# EAGLE design USB_Type_A_Female_Breakout (EAGLE 6.5.0)
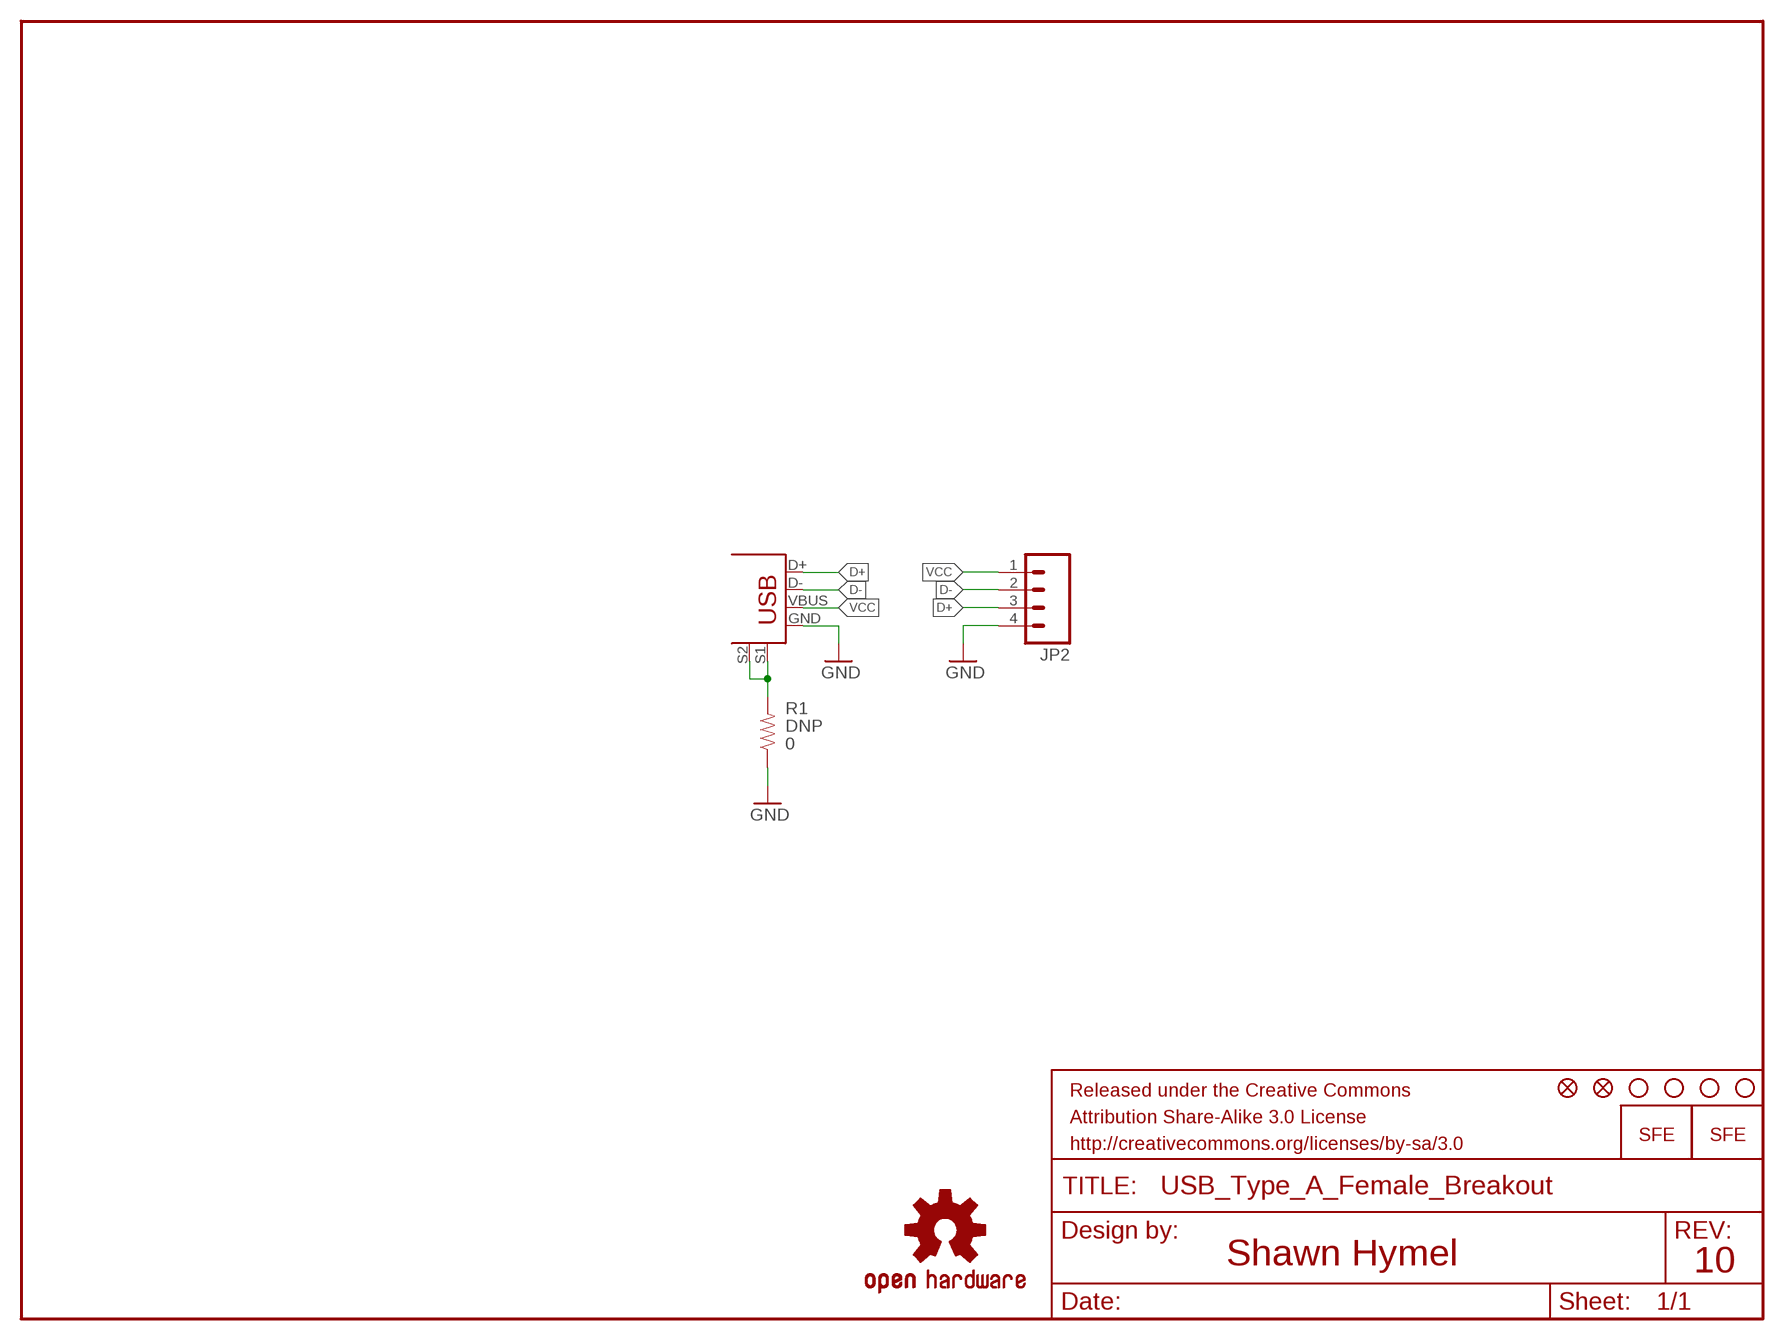
[diagram p0: schematic, sheet 1]

## Parts
FID1  FIDUCIAL1X2  [FIDUCIAL-1X2]
FID2  FIDUCIAL1X2  [FIDUCIAL-1X2]
FRAME1  FRAME-LETTER  [CREATIVE_COMMONS]
JP1  USB+SHIELDUSB-A-S-NOSILK-FEMALE  [USB-A-S-NOSILK-FEMALE]
JP2  M04PTH  [1X04]
LOGO1  LOGO-SFENEW  [SFE-NEW-WEBLOGO]
LOGO2  OSHW-LOGOS  [OSHW-LOGO-S]
LOGO3  LOGO-SFESK  [SFE-LOGO-FLAME]
R1  0  RESISTOR0603  [0603-RES]
STANDOFF1  STAND-OFF  [STAND-OFF]
STANDOFF2  STAND-OFF  [STAND-OFF]
STANDOFF3  STAND-OFF  [STAND-OFF]
STANDOFF4  STAND-OFF  [STAND-OFF]

## Nets
D+: JP1.D+ JP2.3
D-: JP1.D- JP2.2
GND: JP1.GND JP2.4 R1.1
N$1: JP1.S1 JP1.S2 R1.2
VCC: JP1.VBUS JP2.1

## Notes on the sheet
- Shawn Hymel | 10

## Library data of the parts
FID1 FID2 = SparkFun-Aesthetics:FIDUCIAL: Fiducial Alignment Points Various fiducial points for machine vision alignment.
FRAME1 = SparkFun-Aesthetics:FRAME-LETTER: Schematic Frame Standard 8.5x11 US Letter frame
JP1 = SparkFun-Connectors:USB+SHIELD: USB+Shield USB connector with shield pins connectable
JP2 = SparkFun-Connectors:M04: Header 4 Standard 4-pin 0.1" header. Use with straight break away headers (SKU : PRT-00116), right angle break away headers (PRT-00553), swiss pins (PRT-00743), machine pins (PRT-00117), and female headers (PRT-00115). Molex polarized connector foot print use with SKU : PRT-08231 with associated crimp pins and housings. 1MM SMD Version SKU: PRT-10208
LOGO1 LOGO3 = SparkFun-Aesthetics:LOGO-SFE: Spark Fun Electronics PCB Logo This is the standard Spark Fun Electronics PCB logo.
LOGO2 = SparkFun-Aesthetics:OSHW-LOGO: Open Source Hardware Logo This logo indicates the piece of hardware it is found on incorporates a OSHW license and/or adheres to the definition of open source hardware found here: http://freedomdefined.org/OSHW
R1 = SparkFun-Resistors:RESISTOR: Resistor Basic schematic elements and footprints for 0603, 1206, and PTH resistors.; PLACE: DNP
STANDOFF1-STANDOFF4 = SparkFun-Electromechanical:STAND-OFF: #4 Stand Off This is the mechanical footprint for a #4 phillips button head screw. Use the keepout ring to avoid running the screw head into surrounding components. SKU : PRT-00447

## Board
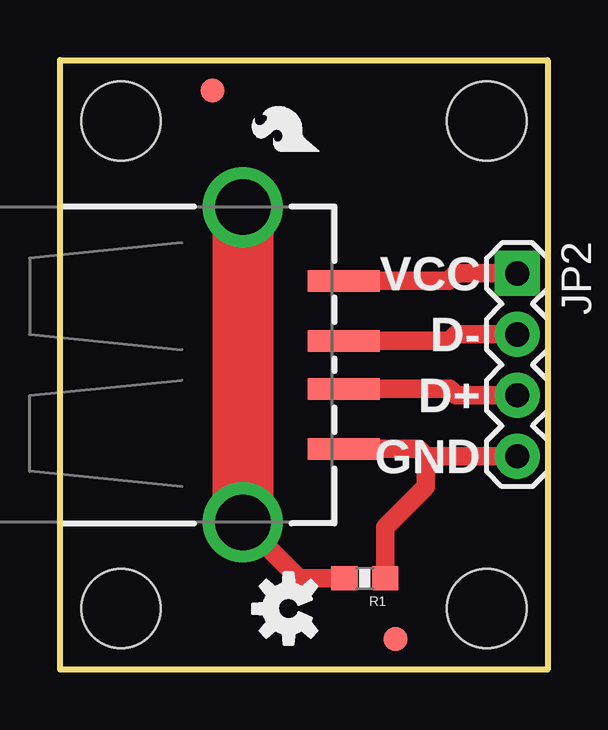
[diagram p1: board, top side]
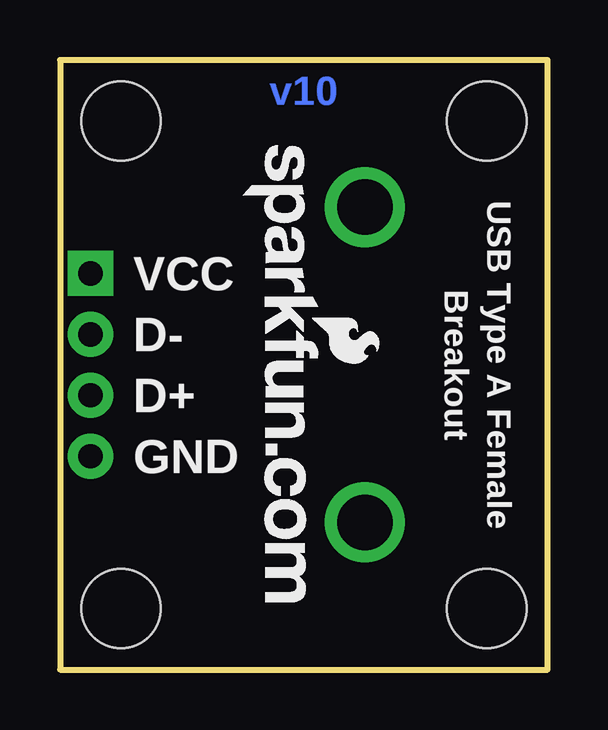
[diagram p2: board, bottom side, seen from below]

Size 20.32 x 25.4 mm. Coordinates in mm from the lower left corner, seen from the top.
Outline: 0,0 0,25.4 20.32,25.4 20.32,0 0,0
Copper layers (1*16): Top 0.035mm / dielectric 1.5mm / Bottom 0.035mm
Design rules "SparkFun-2-layer": minimum track width 7mil, minimum drill 15mil, track to track 8mil, track to pad 8mil, pad to pad 8mil, via to via 8mil, smd to smd 8mil, copper to edge 8mil, drill to drill 8mil, minimum pad ring 12mil, minimum via ring 10mil, stop-mask expansion 4mil, vias tented up to drill 20mil, thermal gap 10mil

### Footprints (pad centres in the part's own frame; a part is rotated, then mirrored left to right if it is on the bottom)
FIDUCIAL-1X2 = smd 1 x 1: 1 0,0
USB-A-S-NOSILK-FEMALE = smd 3 x 0.9: D+ 4.212,-1; D- 4.212,1; GND 4.212,-3.5; VBUS 4.212,3.5 | drill 2.311: S1 0,-6.566; S2 0,6.566
1X04 = drill 1.016 pad 1.88 square: 1 0,0 | drill 1.016 pad 1.88: 2 2.54,0; 3 5.08,0; 4 7.62,0
0603-RES = smd 1.1 x 1: 1 -0.85,0; 2 0.85,0
STAND-OFF = hole 3.302: 0,0

### Placement (x,y rotation side)
FID1  13.97,1.27 0 top
FID2  6.35,24.13 0 top
FRAME1  -15.24,-20.32 0 top  (outside the outline)
JP1  7.62,12.7 0 top
JP2  19.05,16.51 270 top
LOGO1  12.7,21.84 270 bottom
LOGO2  9.53,2.54 90 top
LOGO3  10.79,21.59 90 top
R1  12.7,3.81 180 top
STANDOFF1  2.54,22.86 0 top
STANDOFF2  2.54,2.54 0 top
STANDOFF3  17.78,22.86 0 top
STANDOFF4  17.78,2.54 0 top

### Tracks (layer width: path | path; a pad name or v marks a point on that pad's centre or on a via)
D+
  Top 0.762: JP1.D+ 16.24,11.7 16.51,11.43 JP2.3
D-
  Top 0.762: JP1.D- 16.24,13.7 16.51,13.97 JP2.2
GND
  Top 0.762: R1.1 13.55,5.93 15.24,7.62 15.24,8.89 | JP1.GND 14.93,9.2 15.24,8.89 | 15.24,8.89 JP2.4
N$1
  Top 0.762: R1.2 9.94,3.81 JP1.S1
  Top 2.54: JP1.S2 JP1.S1
VCC
  Top 0.762: JP1.VBUS 16.2,16.2 16.51,16.51 JP2.1

### Text on the board
Bottom: v10
tPlace: VCC | D- | D+ | GND
bPlace: VCC | D- | USB Type A Female | Breakout | D+ | GND
Measures: Dimensions in inches.
tDocu: Shawn Hymel